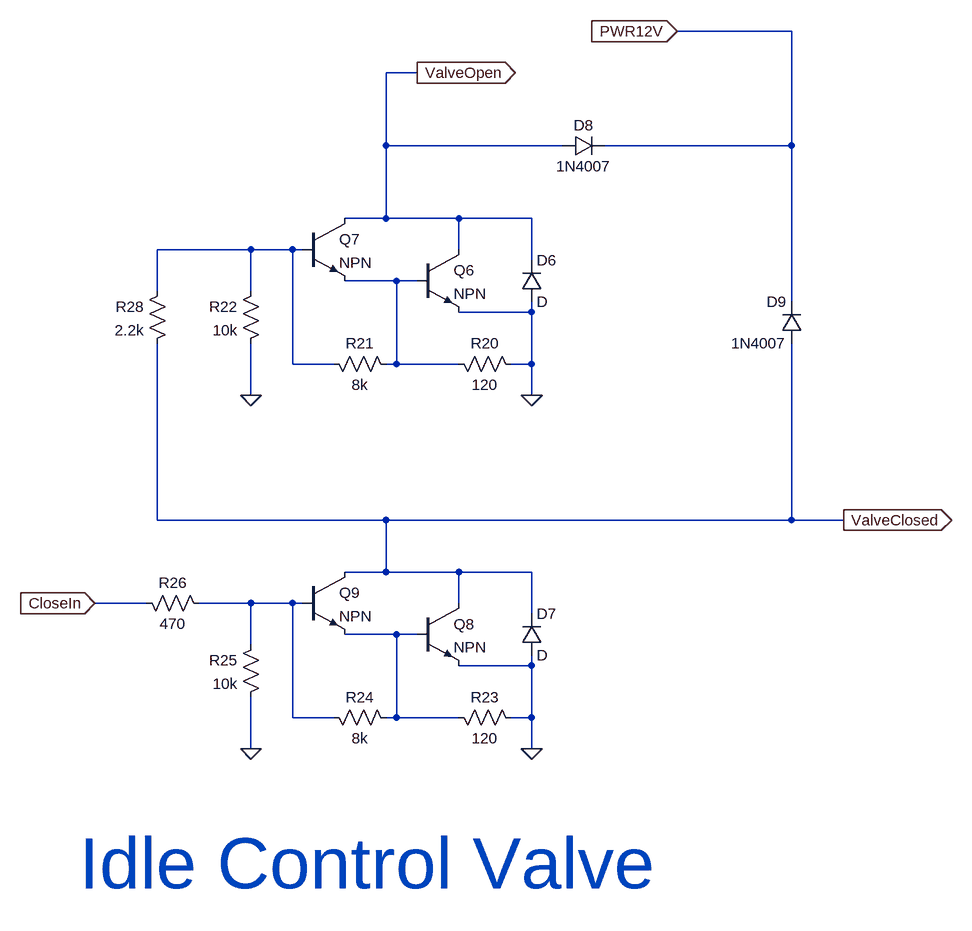
[diagram p0: schematic dme_analog_idle_control.asc]
dme_analog_idle_control.asc, the LTspice schematic file:
Version 4
SHEET 1 4356 3824
WIRE -1360 -1152 -1536 -1152
WIRE -1936 -1088 -1984 -1088
WIRE -1984 -976 -1984 -1088
WIRE -1712 -976 -1984 -976
WIRE -1360 -976 -1360 -1152
WIRE -1360 -976 -1648 -976
WIRE -1984 -864 -1984 -976
WIRE -1984 -864 -2048 -864
WIRE -1872 -864 -1984 -864
WIRE -1760 -864 -1872 -864
WIRE -2192 -816 -2336 -816
WIRE -2128 -816 -2192 -816
WIRE -2112 -816 -2128 -816
WIRE -1872 -816 -1872 -864
WIRE -1760 -800 -1760 -864
WIRE -1968 -768 -2048 -768
WIRE -1936 -768 -1968 -768
WIRE -2336 -752 -2336 -816
WIRE -2192 -752 -2192 -816
WIRE -1360 -736 -1360 -976
WIRE -1760 -720 -1760 -736
WIRE -1760 -720 -1872 -720
WIRE -2128 -640 -2128 -816
WIRE -2064 -640 -2128 -640
WIRE -1968 -640 -1968 -768
WIRE -1968 -640 -1984 -640
WIRE -1872 -640 -1968 -640
WIRE -1760 -640 -1760 -720
WIRE -1760 -640 -1792 -640
WIRE -2192 -592 -2192 -672
WIRE -1760 -592 -1760 -640
WIRE -2336 -400 -2336 -672
WIRE -1984 -400 -2336 -400
WIRE -1360 -400 -1360 -672
WIRE -1360 -400 -1984 -400
WIRE -1280 -400 -1360 -400
WIRE -1984 -320 -1984 -400
WIRE -1984 -320 -2048 -320
WIRE -1872 -320 -1984 -320
WIRE -1760 -320 -1872 -320
WIRE -2352 -272 -2432 -272
WIRE -2192 -272 -2272 -272
WIRE -2128 -272 -2192 -272
WIRE -2112 -272 -2128 -272
WIRE -1872 -272 -1872 -320
WIRE -1760 -256 -1760 -320
WIRE -1968 -224 -2048 -224
WIRE -1936 -224 -1968 -224
WIRE -2192 -208 -2192 -272
WIRE -1760 -176 -1760 -192
WIRE -1760 -176 -1872 -176
WIRE -2128 -96 -2128 -272
WIRE -2064 -96 -2128 -96
WIRE -1968 -96 -1968 -224
WIRE -1968 -96 -1984 -96
WIRE -1872 -96 -1968 -96
WIRE -1760 -96 -1760 -176
WIRE -1760 -96 -1792 -96
WIRE -2192 -48 -2192 -128
WIRE -1760 -48 -1760 -96
FLAG -1936 -1088 ValveOpen
IOPIN -1936 -1088 Out
FLAG -2192 -592 0
FLAG -2192 -48 0
FLAG -1280 -400 ValveClosed
IOPIN -1280 -400 Out
FLAG -1760 -48 0
FLAG -1760 -592 0
FLAG -2432 -272 CloseIn
IOPIN -2432 -272 In
FLAG -1536 -1152 PWR12V
IOPIN -1536 -1152 In
SYMBOL npn -1936 -816 R0
SYMATTR InstName Q6
SYMBOL npn -2112 -864 R0
SYMATTR InstName Q7
SYMBOL diode -1776 -736 M180
WINDOW 0 24 64 Left 2
WINDOW 3 24 0 Left 2
SYMATTR InstName D6
SYMBOL Res -1888 -656 M90
WINDOW 0 0 56 VBottom 2
WINDOW 3 32 56 VTop 2
SYMATTR InstName R20
SYMATTR Value 120
SYMBOL Res -1968 -624 M270
WINDOW 0 32 56 VTop 2
WINDOW 3 0 56 VBottom 2
SYMATTR InstName R21
SYMATTR Value 8k
SYMBOL Res -2176 -768 M0
SYMATTR InstName R22
SYMATTR Value 10k
SYMBOL npn -1936 -272 R0
SYMATTR InstName Q8
SYMBOL npn -2112 -320 R0
SYMATTR InstName Q9
SYMBOL diode -1776 -192 M180
WINDOW 0 24 64 Left 2
WINDOW 3 24 0 Left 2
SYMATTR InstName D7
SYMBOL Res -1888 -112 M90
WINDOW 0 0 56 VBottom 2
WINDOW 3 32 56 VTop 2
SYMATTR InstName R23
SYMATTR Value 120
SYMBOL Res -1968 -80 M270
WINDOW 0 32 56 VTop 2
WINDOW 3 0 56 VBottom 2
SYMATTR InstName R24
SYMATTR Value 8k
SYMBOL Res -2176 -224 M0
SYMATTR InstName R25
SYMATTR Value 10k
SYMBOL Res -2368 -288 M90
WINDOW 0 0 56 VBottom 2
WINDOW 3 32 56 VTop 2
SYMATTR InstName R26
SYMATTR Value 470
SYMBOL diode -1712 -960 R270
WINDOW 0 32 32 VTop 2
WINDOW 3 0 32 VBottom 2
SYMATTR InstName D8
SYMATTR Value 1N4007
SYMBOL Res -2320 -768 M0
SYMATTR InstName R28
SYMATTR Value 2.2k
SYMBOL diode -1344 -672 R180
WINDOW 0 24 64 Left 2
WINDOW 3 24 0 Left 2
SYMATTR InstName D9
SYMATTR Value 1N4007
TEXT -2456 128 Left 7 ;Idle Control Valve

The netlist it stands for:
* dme_analog_idle_control.asc
Q6 ValveOpen N002 0 0 NPN
Q7 ValveOpen N001 N002 0 NPN
D6 0 ValveOpen D
R20 N002 0 120
R21 N002 N001 8k
R22 N001 0 10k
Q8 ValveClosed N004 0 0 NPN
Q9 ValveClosed N003 N004 0 NPN
D7 0 ValveClosed D
R23 N004 0 120
R24 N004 N003 8k
R25 N003 0 10k
R26 CloseIn N003 470
D8 ValveOpen PWR12V 1N4007
R28 N001 ValveClosed 2.2k
D9 ValveClosed PWR12V 1N4007
.model D D
.lib standard.dio
.model NPN NPN
.model PNP PNP
.lib standard.bjt
* Idle Control Valve
.backanno
.end